# Altium project QUTMS-SHDN-IMD-V00.PrjPcb
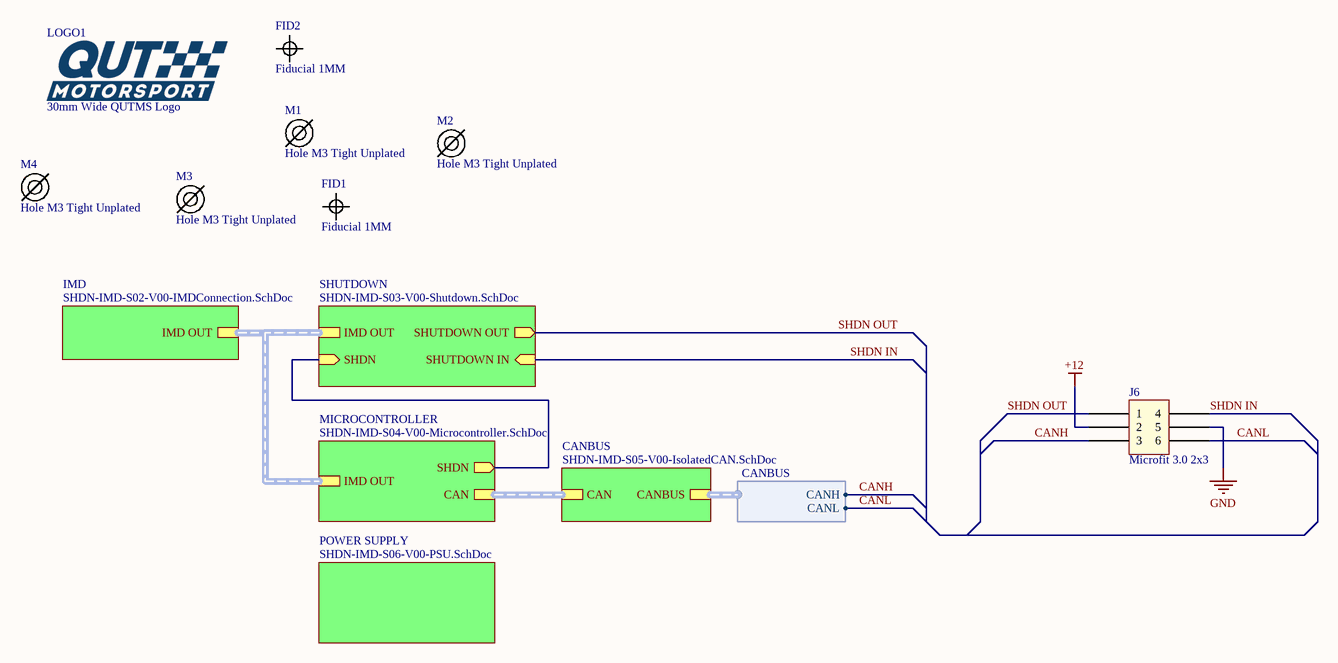
[diagram p0: SHDN-IMD-S01-V00-IMDDaughter.SchDoc]
6 sheets, 70 parts. Net scope: hierarchical (ports join the sheet entries above them; power ports are global).
Board file: SHDN-IMD-S00-V00-IMDDaughter.PcbDoc
Sheets:
  SHDN-IMD-S01-V00-IMDDaughter.SchDoc
    SHUTDOWN = SHDN-IMD-S03-V00-Shutdown.SchDoc
    IMD = SHDN-IMD-S02-V00-IMDConnection.SchDoc
    MICROCONTROLLER = SHDN-IMD-S04-V00-Microcontroller.SchDoc
    CANBUS = SHDN-IMD-S05-V00-IsolatedCAN.SchDoc
    POWER SUPPLY = SHDN-IMD-S06-V00-PSU.SchDoc

## Sheet SHDN-IMD-S01-V00-IMDDaughter.SchDoc: IMD BOARD
size A3; Date: 10/07/2020; DrawnBy: Alikhan Hassan; DocumentNumber: 1; Revision: 00; SheetNumber: 1; SheetTotal: 6; Project: IMD Daughter board 2020; Version: 01; Application_BuildNumber: 00

### Parts
FID1  Fiducial 1MM  [FIDUCIAL 1MM]
FID2  Fiducial 1MM  [FIDUCIAL 1MM]
J6  Microfit 3.0 2x3  [Microfit_2X3_R_TH]
LOGO1  30mm Wide QUTMS Logo  [QUTMS LOGO 30MM]
M1  Hole M3 Tight Unplated  [M3.2 UNPLATED]
M2  Hole M3 Tight Unplated  [M3.2 UNPLATED]
M3  Hole M3 Tight Unplated  [M3.2 UNPLATED]
M4  Hole M3 Tight Unplated  [M3.2 UNPLATED]

### Sub-sheets
CANBUS = SHDN-IMD-S05-V00-IsolatedCAN.SchDoc: CANBUS (harness CANBUS), CAN (harness CAN)
IMD = SHDN-IMD-S02-V00-IMDConnection.SchDoc: IMD OUT (harness IMD OUT)
MICROCONTROLLER = SHDN-IMD-S04-V00-Microcontroller.SchDoc: IMD OUT (harness IMD OUT), SHDN (out), CAN (harness CAN)
POWER SUPPLY = SHDN-IMD-S06-V00-PSU.SchDoc: no entries
SHUTDOWN = SHDN-IMD-S03-V00-Shutdown.SchDoc: SHUTDOWN IN (in), SHUTDOWN OUT (out), IMD OUT (harness IMD OUT), SHDN (in)

### Harnesses
CANBUS: CANH, CANL

### Nets
+12: J6.2
GND: J6.5
CANH: J6.3 ; sheet CANBUS/CANBUS.CANH  [project net CAN H]
CANL: J6.6 ; sheet CANBUS/CANBUS.CANL  [project net CAN L]
IMD STAT: sheet SHUTDOWN/SHDN, sheet MICROCONTROLLER/SHDN
SHDN IN: J6.4 ; sheet SHUTDOWN/SHUTDOWN IN
SHDN OUT: J6.1 ; sheet SHUTDOWN/SHUTDOWN OUT

### Buses and harness runs
harness sheet CANBUS/CAN = sheet MICROCONTROLLER/CAN
harness sheet IMD/IMD OUT = sheet MICROCONTROLLER/IMD OUT = sheet SHUTDOWN/IMD OUT

### Notes on the sheet
- Revision History:
- Sheet Title:
- Rev
- Date
- Description
- Project:
- Size:
- Drawn By:
- A3
- Number:
- Revision:
- Sheet
- Version:
- of
- QUT Motorsport
- O-120, Gardens Point
- 2 George Street
- Brisbane, QLD 4000
- Australia
- Print Date:
- Print Time:
- File Name:

### Library data of the parts
J6 = Microfit_2x3
LOGO1 = QUTMS Logo 30mm
M1-M4 = Hole M3 Tight Unplated: M3.2 Hole, No Plating

## Sheet SHDN-IMD-S03-V00-Shutdown.SchDoc: Shutdown Chain
size A3; Date: 10/07/2020; DrawnBy: Alikhan Hassan; DocumentNumber: 5; Revision: 00; SheetNumber: 5; SheetTotal: 6; Project: IMD Daughter Board 2020; Version: 01
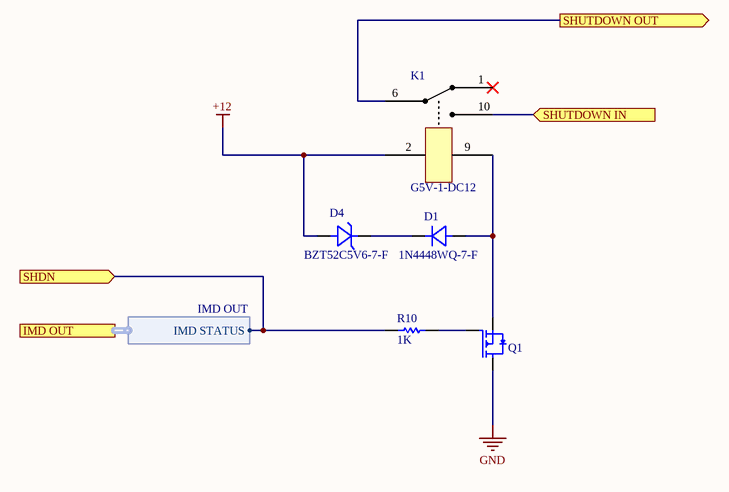
[diagram p1: SHDN-IMD-S03-V00-Shutdown.SchDoc]

### Parts
D1  1N4448WQ-7-F  [SMA]
D4  BZT52C5V6-7-F  [SOD123]
K1  G5V-1-DC12  [G5V-1]
Q1  BST82,215  [PMV15UNEAR]  (value not drawn)
R10  1K  [Res_ThinFilm_0603]

### Ports
IMD OUT (harness IMD OUT), SHDN (in), SHUTDOWN IN (in), SHUTDOWN OUT (out)

### Harnesses
IMD OUT: IMD STATUS

### Nets
+12: D4.A(Anode) K1.2
GND: Q1.D(Drain)
IMD STAT: R10.1 ; port SHDN, port IMD OUT.IMD STATUS
SHDN IN: K1.10 ; port SHUTDOWN IN
SHDN OUT: K1.6 ; port SHUTDOWN OUT
NetD1_A: D1.A(Anode) K1.9 Q1.S(Source)
NetD1_K: D1.K(Cathode) D4.K(Cathode)
NetQ1_G: Q1.G(Gate) R10.2

Not connected (* = marked no-connect by the designer): K1 1*

### Notes on the sheet
- Revision History:
- Sheet Title:
- Rev
- Date
- Description
- Project:
- Size:
- Drawn By:
- A3
- Number:
- Revision:
- Sheet
- Version:
- of
- QUT Motorsport
- O-120, Gardens Point
- 2 George Street
- Brisbane, QLD 4000
- Australia
- Print Date:
- Print Time:
- File Name:

### Library data of the parts
D1 = 1N4448WQ-7-F: Diode, SMD, 75V, 5%, 250mA, SOD123; Manufacturer: ON Semiconductor / Fairchild; Manufacturer Part Number: 1N914BWS; Average Rectified Current: 150mA; Element Configuration: Single; Forward Voltage: 1V; Max Reverse Leakage Current: 5uA; Power Dissipation: 200mW; Recovery Time: 4ns; Max Forward Surge Current (Ifsm): 4A; Parameter 1: *; Weight: 0.0276g; Category: Rectifier Diodes; Contact Plating: Tin,Matte; Forward Current: 150mA; Lead Free: Lead Free; Max Operating Temperature: 150°C; Max Repetitive Reverse Voltage (Vrrm): 75V; Max Reverse Voltage (DC): 75V; Min Operating Temperature: -55°C; Mount: Surface Mount; Number of Pins: 2; Package Quantity: 1; Packaging: Tape and Reel; Peak Reverse Current: 5uA; Radiation Hardening: No; REACH SVHC: No SVHC; Reverse Recovery Time: 4ns; Height: 1mm; Length: 1.8mm; Reverse Voltage: 75V; Width: 1.35mm
D4 = BZT52C5V6-7-F: Diode, SMD, Zender, 5.6V, 7%, 500mW, SOD-123; Manufacturer: Generic; MPN: 1.8V 500mW
K1 = G5V-1-DC12: General Purpose Relay SPDT (1 Form C) Through Hole, 12V, 2A
Q1 = PMV15UNEAR: MOSFET N-CH 100V 190MA SOT-23; Manufacturer: Nexperia
R10 = 1k 5% 0603: Resistor, SMD, 1k, 0.1W, 5%, 0603

## Sheet SHDN-IMD-S02-V00-IMDConnection.SchDoc: IMD Connection
size A3; DrawnBy: Alikhan Hassan; DocumentNumber: 6; Revision: 00; SheetNumber: 6; SheetTotal: 6; Version: 01; Project: IMD Daughter Board 2020
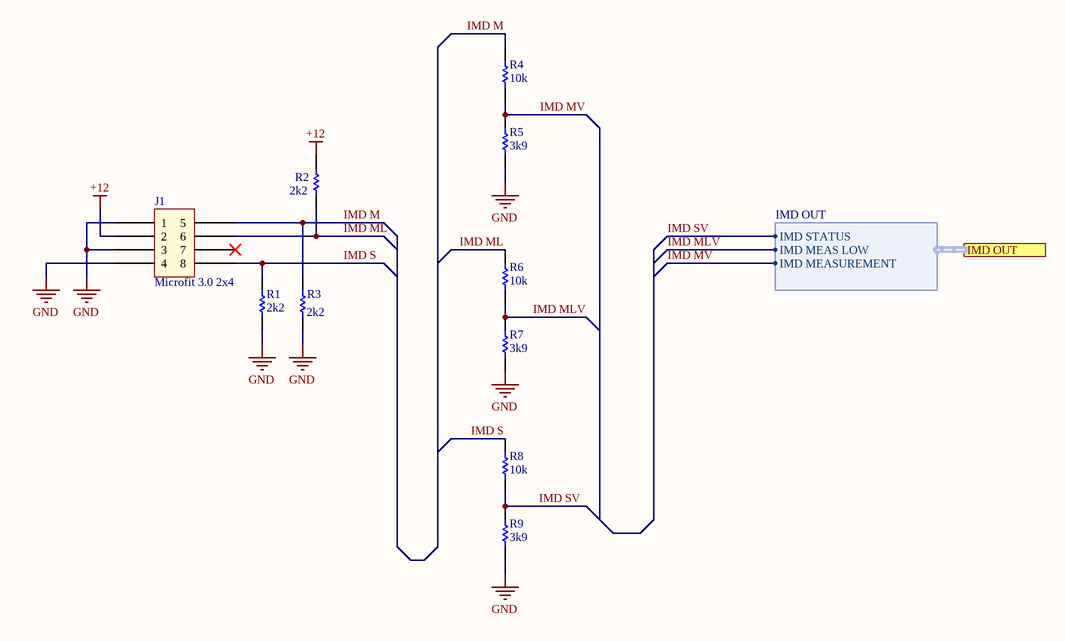
[diagram p2: SHDN-IMD-S02-V00-IMDConnection.SchDoc]

### Parts
J1  Microfit 3.0 2x4  [Microfit_2X4_R_TH]
R1  2k2  [Res_ThinFilm_0603]
R2  2k2  [Res_ThinFilm_0603]
R3  2k2  [Res_ThinFilm_0603]
R4  10k  [Res_ThinFilm_0603]
R5  3k9  [Res_ThinFilm_0603]
R6  10k  [Res_ThinFilm_0603]
R7  3k9  [Res_ThinFilm_0603]
R8  10k  [Res_ThinFilm_0603]
R9  3k9  [Res_ThinFilm_0603]

### Ports
IMD OUT (harness IMD OUT)

### Harnesses
IMD OUT: IMD MEASUREMENT, IMD MEAS LOW, IMD STATUS

### Nets
+12: J1.2 R2.2
GND: J1.1 J1.3 J1.4 R1.1 R3.1 R5.1 R7.1 R9.1
IMD M: J1.5 R3.2 R4.2
IMD ML: J1.6 R2.1 R6.2
IMD MLV: R6.1 R7.2 ; port IMD OUT.IMD MEAS LOW  [project net IMD MEAS LOW]
IMD MV: R4.1 R5.2 ; port IMD OUT.IMD MEASUREMENT  [project net IMD MEASUREMENT]
IMD S: J1.8 R1.2 R8.2
IMD SV: R8.1 R9.2 ; port IMD OUT.IMD STATUS  [project net IMD STAT]

Not connected (* = marked no-connect by the designer): J1 7*

### Notes on the sheet
- Revision History:
- Sheet Title:
- Rev
- Date
- Description
- Project:
- Size:
- Drawn By:
- A3
- Number:
- Revision:
- Sheet
- Version:
- of
- QUT Motorsport
- O-120, Gardens Point
- 2 George Street
- Brisbane, QLD 4000
- Australia
- Print Date:
- Print Time:
- File Name:

### Library data of the parts
J1 = Microfit_2x4
R1-R3 = 2k2 5% 0603: Resistor, SMD, 2k2, 0.1W, 5%, 0603
R4 R6 R8 = 10k 1% 0603: Resistor, SMD, 10k, 0.1W, 1%, 0603
R5 R7 R9 = 3k9 5% 0603: Resistor, SMD, 3k9, 0.1W, 5%, 0603

## Sheet SHDN-IMD-S04-V00-Microcontroller.SchDoc: Microcontroller
size A3; DrawnBy: Zoe Goodward; DocumentNumber: 2; Revision: 00; SheetNumber: 2; SheetTotal: 6; Version: 01; Project: IMD Daughter Board 2020; PageSetup: Record=PageOptions|CenterHorizontal=True|CenterVertical=True|PrintScale=0.97|XCorrection=1.00|YCorrection=1.00|PrintKind=0|BorderSize=5000000|LeftOffset=0|BottomOffset=0|Orientation=2|PaperLength=1000|PaperWidth=1000|Scale=100|PaperSource=7|PrintQuality=-4|MediaType=1|DitherType=10|PaperKind=A4|PrintScaleMode=1
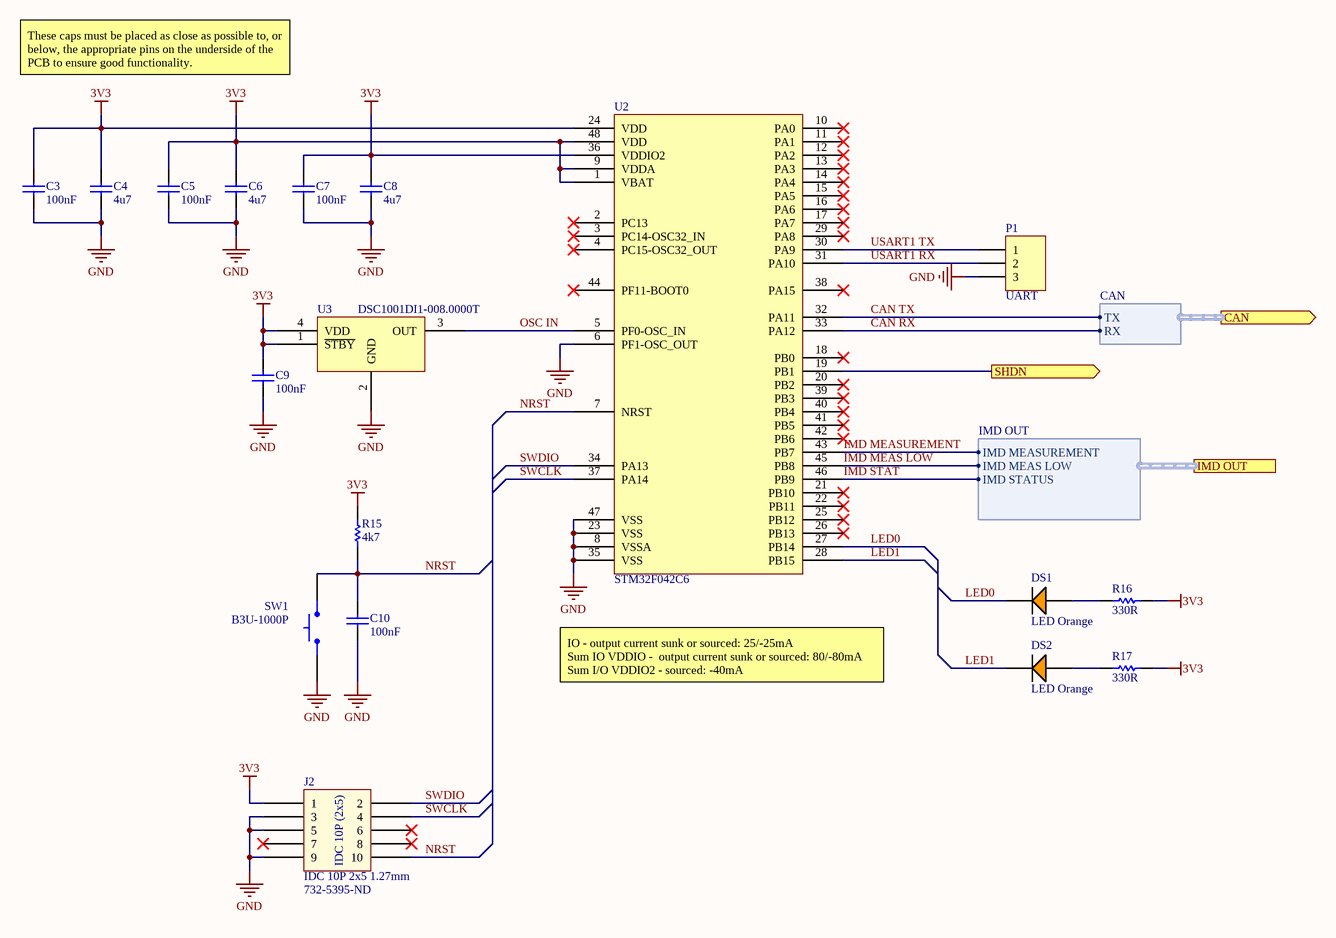
[diagram p3: SHDN-IMD-S04-V00-Microcontroller.SchDoc]

### Parts
C3  100nF  [Cap_Ceramic_0603]
C4  4u7  [Cap_Ceramic_0603]
C5  100nF  [Cap_Ceramic_0603]
C6  4u7  [Cap_Ceramic_0603]
C7  100nF  [Cap_Ceramic_0603]
C8  4u7  [Cap_Ceramic_0603]
C9  100nF  [Cap_Ceramic_0603]
C10  100nF  [Cap_Ceramic_0603]
DS1  LED Orange  [LED ORANGE 0603]
DS2  LED Orange  [LED ORANGE 0603]
J2  IDC 10P 2x5 1.27mm  [IDC 1.27MM 10P]
P1  UART  [HDR1X3]
R15  4k7  [Res_ThinFilm_0603]
R16  330R  [Res_ThinFilm_0603]
R17  330R  [Res_ThinFilm_0603]
SW1  B3U-1000P  [BTN B3U-1000P]
U2  STM32F042C6  [STM32F042C6]
U3  DSC1001DI1-008.0000T  [DSC1001DI1-008.0000TCT-ND]

### Ports
CAN (out, harness CAN), IMD OUT (harness IMD OUT), SHDN (out)

### Harnesses
CAN: TX, RX
IMD OUT: IMD MEASUREMENT, IMD STATUS, IMD MEAS LOW

### Nets
3V3: C3.2 C4.2 C5.2 C6.2 C7.2 C8.2 C9.2 J2.1 R15.2 R16.2 R17.2 U2.1(VBAT) U2.9(VDDA) U2.24(VDD) U2.36(VDDIO2) U2.48(VDD) U3.1(~{STBY}) U3.4(VDD)
GND: C3.1 C4.1 C5.1 C6.1 C7.1 C8.1 C9.1 C10.1 J2.3 J2.5 J2.9 P1.3 SW1.1 U2.6(PF1-OSC_OUT) U2.8(VSSA) U2.23(VSS) U2.35(VSS) U2.47(VSS) U3.2(GND)
CAN RX: U2.33(PA12) ; port CAN.RX
CAN TX: U2.32(PA11) ; port CAN.TX
IMD MEAS LOW: U2.45(PB8) ; port IMD OUT.IMD MEAS LOW
IMD MEASUREMENT: U2.43(PB7) ; port IMD OUT.IMD MEASUREMENT
IMD STAT: U2.19(PB1) U2.46(PB9) ; port SHDN, port IMD OUT.IMD STATUS
LED0: DS1.2(C) U2.27(PB14)
LED1: DS2.2(C) U2.28(PB15)
NRST: C10.2 J2.10 R15.1 SW1.2 U2.7(NRST)
OSC IN: U2.5(PF0-OSC_IN) U3.3(OUT)
SWCLK: J2.4 U2.37(PA14)
SWDIO: J2.2 U2.34(PA13)
USART1 RX: P1.2 U2.31(PA10)
USART1 TX: P1.1 U2.30(PA9)
NetDS1_1: DS1.1(A) R16.1
NetDS2_1: DS2.1(A) R17.1

Not connected (* = marked no-connect by the designer): J2 6* 7* 8*; U2 2(PC13)* 3(PC14-OSC32_IN)* 4(PC15-OSC32_OUT)* 10(PA0)* 11(PA1)* 12(PA2)* 13(PA3)* 14(PA4)* 15(PA5)* 16(PA6)* 17(PA7)* 18(PB0)* 20(PB2)* 21(PB10)* 22(PB11)* 25(PB12)* 26(PB13)* 29(PA8)* 38(PA15)* 39(PB3)* 40(PB4)* 41(PB5)* 42(PB6)* 44(PF11-BOOT0)*

### Notes on the sheet
- These caps must be placed as close as possible to, or below, the appropriate pins on the underside of the PCB to ensure good functionality.
- IO - output current sunk or sourced: 25/-25mA
  Sum IO VDDIO -  output current sunk or sourced: 80/-80mA
  Sum I/O VDDIO2 - sourced: -40mA
- (near J2) 732-5395-ND
- Revision History:
- Sheet Title:
- Rev
- Date
- Description
- Project:
- Size:
- Drawn By:
- A3
- Number:
- Revision:
- Sheet
- Version:
- of
- QUT Motorsport
- O-120, Gardens Point
- 2 George Street
- Brisbane, QLD 4000
- Australia
- Print Date:
- Print Time:
- File Name:
- (in symbol IDC 10P 2x5 1.27mm) IDC 10P (2x5)

### Library data of the parts
C3 C5 C7 = 100nF 100V 5% X7R 0603: Capacitor, Ceramic, SMD, 100nF, 100V, 5%, X7R, 0603
C4 C6 C8 = 4u7 50V 5% X7R 0603: Capacitor, Ceramic, SMD, 4u7, 50V, 5%, X7R, 0603
C9 C10 = 100nF 50V 5% X7R 0603: Capacitor, Ceramic, SMD, 100nF, 50V, 5%, X7R, 0603
DS1 DS2 = LED ORANGE 0603
P1 = Header 3: Header, 3-Pin; LatestRevisionDate: 17-Jul-2002; LatestRevisionNote: Re-released for DXP Platform.; Publisher: Altium Limited
R15 = 4k7 5% 0603: Resistor, SMD, 4k7, 0.1W, 5%, 0603
R16 R17 = 330R 5% 0603: Resistor, SMD, 330R, 0.1W, 5%, 0603
SW1 = BTN B3U-1000P: Omron B3U-1000P Ultra Miniture Switch; ComponentLink1Description: LCSC; ComponentLink1URL: https://lcsc.com/product-detail/Tactile-Switches_BRIGHT-TSA063G50-250_C294565.html
U2 = STM32042C6: ARM® Cortex®-M0 STM32F0 Microcontroller IC 32-Bit 48MHz 32KB (32K x 8) FLASH 48-LQFP (7x7); ComponentLink1Description: Digikey; ComponentLink1URL: https://www.digikey.com.au/product-detail/en/stmicroelectronics/STM32F042C6T6TR/497-19319-1-ND/10063344; ComponentLink2Description: Datasheet; ComponentLink2URL: https://www.st.com/resource/en/datasheet/stm32f042k6.pdf
U3 = DSC1001DI1-008.0000T: on 8MHz XO (Standard) CMOS Oscillator 1.8 ~ 3.3V Standby (Power Down) 4-SMD, No Lead

## Sheet SHDN-IMD-S05-V00-IsolatedCAN.SchDoc: Isolated CANBUS
size A3; DrawnBy: Jonn Dillon; DocumentNumber: 3; Revision: 01; SheetNumber: 3; SheetTotal: 6; Version: 01; Project: IMD Daughter Board 2020; PageSetup: Record=PageOptions|CenterHorizontal=True|CenterVertical=True|PrintScale=0.97|XCorrection=1.00|YCorrection=1.00|PrintKind=0|BorderSize=5000000|LeftOffset=0|BottomOffset=0|Orientation=2|PaperLength=1000|PaperWidth=1000|Scale=100|PaperSource=7|PrintQuality=-4|MediaType=1|DitherType=10|PaperKind=A4|PrintScaleMode=1
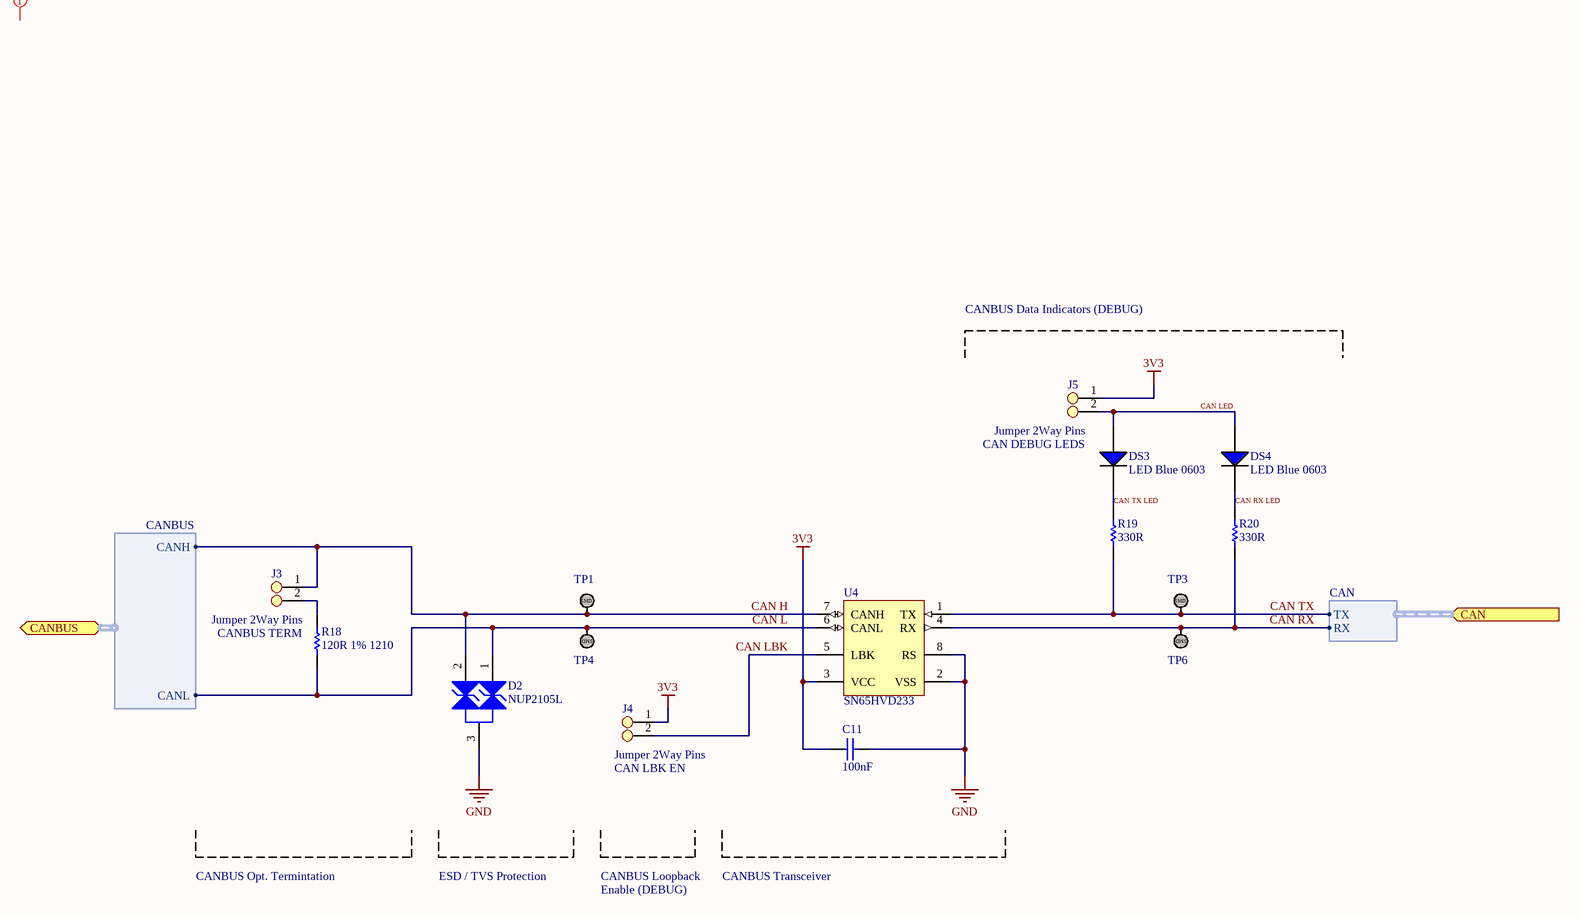
[diagram p4: SHDN-IMD-S05-V00-IsolatedCAN.SchDoc]

### Parts
C11  100nF  [Cap_Ceramic_0603]
D2  NUP2105L  [NUP2105L]
DS3  LED Blue 0603  [LED BLUE 0603]
DS4  LED Blue 0603  [LED BLUE 0603]
J3  Jumper 2Way Pins  [Jumper_2Way_Pin]
J4  Jumper 2Way Pins  [Jumper_2Way_Pin]
J5  Jumper 2Way Pins  [Jumper_2Way_Pin]
R18  120R 1% 1210  [Res_ThinFilm_1210]
R19  330R  [Res_ThinFilm_0603]
R20  330R  [Res_ThinFilm_0603]
TP1  TestPoint_SMD  [TestPointSMD]  (value not drawn)
TP3  TestPoint_SMD  [TestPointSMD]  (value not drawn)
TP4  TestPoint_SMD  [TestPointSMD]  (value not drawn)
TP6  TestPoint_SMD  [TestPointSMD]  (value not drawn)
U4  SN65HVD233  [SN65HVD233DR]

### Ports
CAN (in, harness CAN), CANBUS (bidir, harness CANBUS)

### Harnesses
CANBUS: CANH, CANL
CAN: RX, TX

### Nets
3V3: C11.1 J4.1 J5.1 U4.3(VCC)
GND: C11.2 D2.3 U4.2(VSS) U4.8(RS)
CAN H: D2.2 J3.1 TP1.1 U4.7(CANH) ; port CANBUS.CANH
CAN L: D2.1 R18.1 TP4.1 U4.6(CANL) ; port CANBUS.CANL
CAN LBK: J4.2 U4.5(LBK)
CAN LED: DS3.1(A) DS4.1(A) J5.2
CAN RX: R20.1 TP6.1 U4.4(RX) ; port CAN.RX
CAN RX LED: DS4.2(C) R20.2
CAN TX: R19.1 TP3.1 U4.1(TX) ; port CAN.TX
CAN TX LED: DS3.2(C) R19.2
NetJ3_2: J3.2 R18.2

### Layout directives
mark named ISO: (no net found under the mark)

### Notes on the sheet
- CANBUS Data Indicators (DEBUG)
- CAN DEBUG LEDS
- (near R18) CANBUS TERM
- (near J4) CAN LBK EN
- CANBUS Opt. Termintation
- ESD / TVS Protection
- CANBUS Loopback
- Enable (DEBUG)
- CANBUS Transceiver
- Revision History:
- Sheet Title:
- Rev
- Date
- Description
- Project:
- Size:
- Drawn By:
- A3
- Number:
- Revision:
- Sheet
- Version:
- of
- QUT Motorsport
- O-120, Gardens Point
- 2 George Street
- Brisbane, QLD 4000
- Australia
- Print Date:
- Print Time:
- File Name:
- (in symbol TestPoint_SMD) SMD

### Library data of the parts
C11 = 100nF 100V 5% X7R 0603: as C3 on sheet SHDN-IMD-S04-V00-Microcontroller
J3-J5 = Jumper 2Way Side Pins
R18 = 120R 1% 1210: Resistor, SMD, 120R, 0.25W, 1%, 1210
R19 R20 = 330R 5% 0603: Resistor, SMD, 330R, 0.1W, 5%, 0603
D2 = NUP2105L: ComponentLink1Description: Datasheet; ComponentLink1URL: https://www.onsemi.cn/PowerSolutions/document/NUP2105L-D.PDF; Parameter 1: *; ComponentLink2Description: LCSC; ComponentLink2URL: https://lcsc.com/product-detail/TVS_ON-Semiconductor-NUP2105LT1G_C14486.html; ComponentLink3Description: Digikey; ComponentLink3URL: https://www.digikey.com.au/product-detail/en/on-semiconductor/SZNUP2105LT1G/SZNUP2105LT1GOSCT-ND/3487669
U4 = SN65HVD233: ComponentLink1Description: LCSC; ComponentLink1URL: https://lcsc.com/product-detail/CAN-ICs_Texas-Instruments_SN65HVD233DRG4_Texas-Instruments-Texas-Instruments-SN65HVD233DRG4_C61643.html; ComponentLink2Description: Digikey; ComponentLink2URL: https://www.digikey.com.au/product-detail/en/texas-instruments/SN65HVD233DR/296-35967-1-ND/4134960; ComponentLink3Description: Datasheet; ComponentLink3URL: https://www.ti.com/lit/ds/symlink/sn65hvd233.pdf?ts=1588560888178; ComponentLink4Description: Ti Product Page; ComponentLink4URL: https://www.ti.com/product/SN65HVD233

## Sheet SHDN-IMD-S06-V00-PSU.SchDoc: Power Supply
size A3; DrawnBy: Jonn Dillon; DocumentNumber: 4; Revision: 00; SheetNumber: 4; SheetTotal: 6; Version: 01; Project: IMD Daughter Board 2020; PageSetup: Record=PageOptions|CenterHorizontal=True|CenterVertical=True|PrintScale=0.97|XCorrection=1.00|YCorrection=1.00|PrintKind=0|BorderSize=5000000|LeftOffset=0|BottomOffset=0|Orientation=2|PaperLength=1000|PaperWidth=1000|Scale=100|PaperSource=7|PrintQuality=-4|MediaType=1|DitherType=10|PaperKind=A4|PrintScaleMode=1
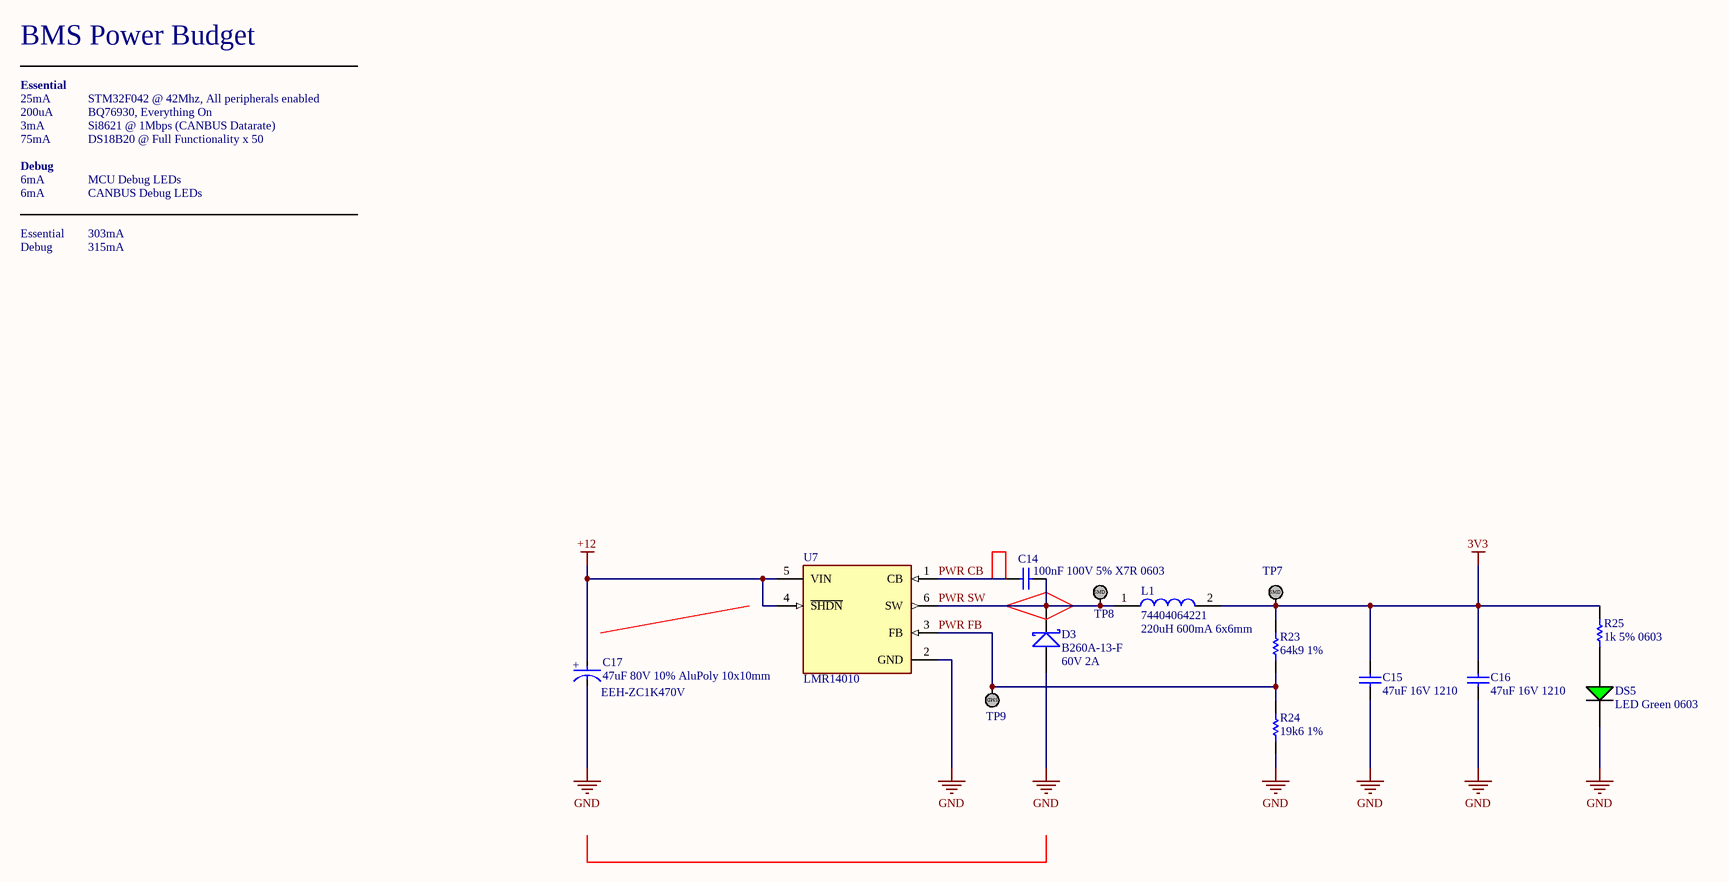
[diagram p5: SHDN-IMD-S06-V00-PSU.SchDoc]

### Parts
C14  100nF 100V 5% X7R 0603  [Cap_Ceramic_0603]
C15  47uF 16V 1210  [Cap_Ceramic_0603]
C16  47uF 16V 1210  [Cap_Ceramic_0603]
C17  47uF 80V 10% AluPoly 10x10mm  [CAP_ALU_10x10mm]
D3  B260A-13-F  [SMA]
DS5  LED Green 0603  [LED GREEN 0603]
L1  74404064221  [Inductor_6x6mm]
R23  64k9 1%  [Res_ThinFilm_0603]
R24  19k6 1%  [Res_ThinFilm_0603]
R25  1k 5% 0603  [Res_ThinFilm_0603]
TP7  TestPoint_SMD  [TestPointSMD]  (value not drawn)
TP8  TestPoint_SMD  [TestPointSMD]  (value not drawn)
TP9  TestPoint_SMD  [TestPointSMD]  (value not drawn)
U7  LMR14010  [LMR14010]

### Nets
3V3: C15.2 C16.2 L1.2 R23.2 R25.2 TP7.1
+12: C17.A U7.4(~{SHDN}) U7.5(VIN)
GND: C15.1 C16.1 C17.K D3.A DS5.2(C) R24.1 U7.2(GND)
PWR CB: C14.1 U7.1(CB)
PWR FB: R23.1 R24.2 TP9.1 U7.3(FB)
PWR SW: C14.2 D3.K L1.1 TP8.1 U7.6(SW)
NetDS5_1: DS5.1(A) R25.1

### Notes on the sheet
- BMS Power Budget
- 25mA
- 200uA
- Essential
- STM32F042 @ 42Mhz, All peripherals enabled
- BQ76930, Everything On
- 3mA
- 6mA
- Debug
- 75mA
- Si8621 @ 1Mbps (CANBUS Datarate)
- MCU Debug LEDs
- DS18B20 @ Full Functionality x 50
- CANBUS Debug LEDs
- 303mA
- 315mA
- (near L1) 220uH 600mA 6x6mm
- (near C17) EEH-ZC1K470V
- (near D3) 60V 2A
- Revision History:
- Sheet Title:
- Rev
- Date
- Description
- Project:
- Size:
- Drawn By:
- A3
- Number:
- Revision:
- Sheet
- Version:
- of
- QUT Motorsport
- O-120, Gardens Point
- 2 George Street
- Brisbane, QLD 4000
- Australia
- Print Date:
- Print Time:
- File Name:
- (in symbol 47uF 80V 10% AluPoly 10x10mm) +
- (in symbol TestPoint_SMD) SMD

### Library data of the parts
C14 = 100nF 100V 5% X7R 0603: as C3 on sheet SHDN-IMD-S04-V00-Microcontroller
C15 C16 = 47uF 16V 10% X7R 1210: Capacitor, Ceramic, SMD, 47uF, 16V, 5%, X7R, 1210
C17 = 47uF 80V 10% AluPoly 10x10mm: Capacitor, AluPoly, SMD, 47uF, 80V, 10%, AluPoly, 10x10mm
D3 = B260A-13-F: Diode, Schottky Barrier Rectifier, 60 V, 2 A, B260A-13-F
L1 = 74404064221: FIXED IND 220UH 660MA 850 MOHM; ComponentLink1Description: Digikey; ComponentLink1URL: https://www.digikey.com.au/product-detail/en/w%C3%BCrth-elektronik/74404064221/732-7261-1-ND/5353241; ComponentLink2Description: LCSC A; ComponentLink2URL: https://lcsc.com/product-detail/Power-Inductors_Sunlord-SWPA6045S221MT_C91047.html; ComponentLink3Description: LCSC B; ComponentLink3URL: https://lcsc.com/product-detail/Power-Inductors_SXN-Shun-Xiang-Nuo-Elec-SMNR6045-221MT_C467145.html
R23 = 64k9 1% 0603: Resistor, SMD, 64k9, 0.1W, 5%, 0603
R24 = 19k6 1% 0603: Resistor, SMD, 19k6, 0.1W, 5%, 0603
R25 = 1k 5% 0603: Resistor, SMD, 1k, 0.1W, 5%, 0603

## Nets that join several sheets
3V3: SHDN-IMD-S04-V00-Microcontroller (18 pins), SHDN-IMD-S05-V00-IsolatedCAN (C11.1 J4.1 J5.1 U4.3), SHDN-IMD-S06-V00-PSU (6 pins)
+12: SHDN-IMD-S01-V00-IMDDaughter (J6.2), SHDN-IMD-S03-V00-Shutdown (D4.A K1.2), SHDN-IMD-S02-V00-IMDConnection (J1.2 R2.2), SHDN-IMD-S06-V00-PSU (C17.A U7.4 U7.5)
GND: SHDN-IMD-S01-V00-IMDDaughter (J6.5), SHDN-IMD-S03-V00-Shutdown (Q1.D), SHDN-IMD-S02-V00-IMDConnection (8 pins), SHDN-IMD-S04-V00-Microcontroller (19 pins), SHDN-IMD-S05-V00-IsolatedCAN (C11.2 D2.3 U4.2 U4.8), SHDN-IMD-S06-V00-PSU (7 pins)
CAN H: SHDN-IMD-S01-V00-IMDDaughter (J6.3), SHDN-IMD-S05-V00-IsolatedCAN (D2.2 J3.1 TP1.1 U4.7)
CAN L: SHDN-IMD-S01-V00-IMDDaughter (J6.6), SHDN-IMD-S05-V00-IsolatedCAN (D2.1 R18.1 TP4.1 U4.6)
CAN RX: SHDN-IMD-S04-V00-Microcontroller (U2.33), SHDN-IMD-S05-V00-IsolatedCAN (R20.1 TP6.1 U4.4)
CAN TX: SHDN-IMD-S04-V00-Microcontroller (U2.32), SHDN-IMD-S05-V00-IsolatedCAN (R19.1 TP3.1 U4.1)
IMD MEAS LOW: SHDN-IMD-S02-V00-IMDConnection (R6.1 R7.2), SHDN-IMD-S04-V00-Microcontroller (U2.45)
IMD MEASUREMENT: SHDN-IMD-S02-V00-IMDConnection (R4.1 R5.2), SHDN-IMD-S04-V00-Microcontroller (U2.43)
IMD STAT: SHDN-IMD-S03-V00-Shutdown (R10.1), SHDN-IMD-S02-V00-IMDConnection (R8.1 R9.2), SHDN-IMD-S04-V00-Microcontroller (U2.19 U2.46)
SHDN IN: SHDN-IMD-S01-V00-IMDDaughter (J6.4), SHDN-IMD-S03-V00-Shutdown (K1.10)
SHDN OUT: SHDN-IMD-S01-V00-IMDDaughter (J6.1), SHDN-IMD-S03-V00-Shutdown (K1.6)